# Altium project Contadores.PrjPcb
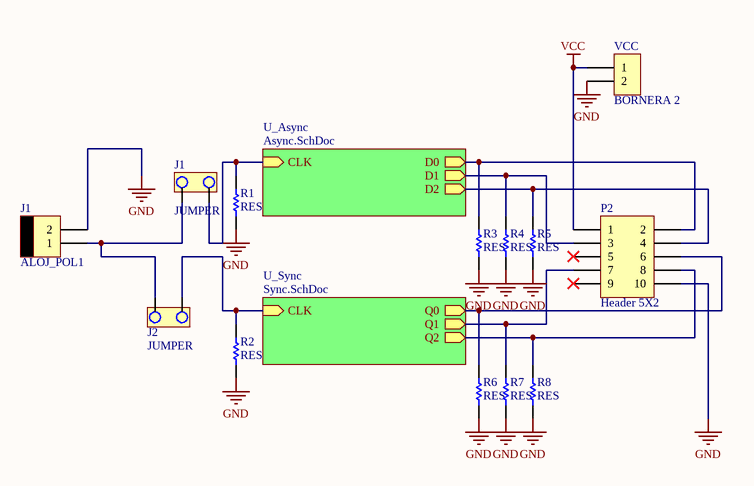
[diagram p0: Counters.SchDoc]
5 sheets, 41 parts. Net scope: hierarchical (ports join the sheet entries above them; power ports are global).
Board file: Counters.PcbDoc
Sheets:
  Counters.SchDoc
    U_Async = Async.SchDoc
      U_JK_FF3 = JK_FF.SchDoc
      U_JK_FF4 = JK_FF.SchDoc
      U_JK_FF5 = JK_FF.SchDoc
    U_Sync = Sync.SchDoc
      U_JK_FF_WITH_AND1 = JK_FF_WITH_AND.SchDoc
      U_JK_FF1 = JK_FF.SchDoc
      U_JK_FF2 = JK_FF.SchDoc

## Sheet Counters.SchDoc
size A

### Parts
(Parts that share a designator on the sheet are numbered #1, #2 ... from top to bottom, then left to right.)
J1#1  JUMPER  [JUMPER2]
J1#2  ALOJ_POL1  [MOLEX2]
J2#1  JUMPER  [JUMPER2]
P2  Header 5X2  [HDR2X5]
R1  RES  [RES400]
R2  RES  [RES400]
R3  RES  [RES400]
R4  RES  [RES400]
R5  RES  [RES400]
R6  RES  [RES400]
R7  RES  [RES400]
R8  RES  [RES400]
VCC  BORNERA 2  [BORNERA2]

### Sub-sheets
U_Async = Async.SchDoc: CLK (in), D0 (out), D1 (out), D2 (out)
U_Sync = Sync.SchDoc: Q0 (out), Q1 (out), Q2 (out), CLK (in)

### Nets
GND: J1#2.2 P2.10 R1.1 R2.1 R3.1 R4.1 R5.1 R6.1 R7.1 R8.1 VCC.2
VCC: P2.1 VCC.1
NetAND2_2: J2#1.2 R2.2 ; sheet U_Sync/CLK
NetAND2_8: P2.8 R8.2 ; sheet U_Sync/Q2
NetCD4073BM#1_2: J1#1.1 R1.2 ; sheet U_Async/CLK
NetCD4073BM#1_8: P2.2 R3.2 ; sheet U_Async/D0
NetCD4073BM#2_8: P2.3 R4.2 ; sheet U_Async/D1
NetCD4073BM#3_8: P2.4 R5.2 ; sheet U_Async/D2
NetCD4073BM#4_8: P2.6 R6.2 ; sheet U_Sync/Q0
NetCD4073BM#5_8: P2.7 R7.2 ; sheet U_Sync/Q1
NetJ1#1_2: J1#1.2 J1#2.1 J2#1.1

Not connected (* = marked no-connect by the designer): P2 5* 9*

### Library data of the parts
J1#2 = MOLEX2
P2 = Header 5X2: Header, 5-Pin, Dual row; LatestRevisionDate: 17-Jul-2002; LatestRevisionNote: Re-released for DXP Platform.; Publisher: Altium Limited

## Sheet Async.SchDoc
size B
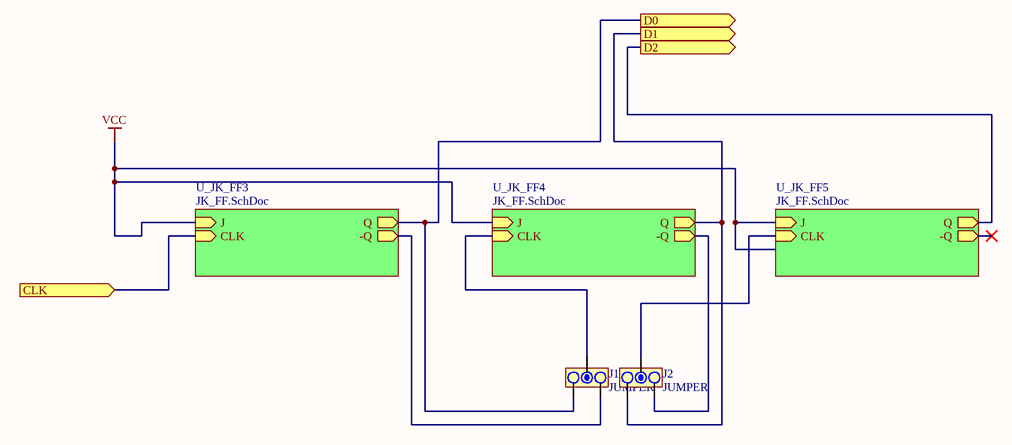
[diagram p1: Async.SchDoc]

### Parts
(Parts that share a designator on the sheet are numbered #1, #2 ... from top to bottom, then left to right.)
J1#3  JUMPER  [JUMPER3]
J2#2  JUMPER  [JUMPER3]

### Sub-sheets
U_JK_FF3 = JK_FF.SchDoc: J (in), CLK (in), Q (out), -Q (out)
U_JK_FF4 = JK_FF.SchDoc: J (in), CLK (in), Q (out), -Q (out)
U_JK_FF5 = JK_FF.SchDoc: J (in), CLK (in), Q (out), -Q (out)

### Ports
CLK (in), D0 (out), D1 (out), D2 (out)

### Nets
VCC: sheet U_JK_FF3/J, sheet U_JK_FF4/J, sheet U_JK_FF5/J
NetCD4073BM#1_2: port CLK, sheet U_JK_FF3/CLK
NetCD4073BM#1_5: J1#3.1 ; sheet U_JK_FF3/-Q
NetCD4073BM#1_8: J1#3.3 ; port D0, sheet U_JK_FF3/Q
NetCD4073BM#2_2: J1#3.2 ; sheet U_JK_FF4/CLK
NetCD4073BM#2_5: J2#2.1 ; sheet U_JK_FF4/-Q
NetCD4073BM#2_8: J2#2.3 ; port D1, sheet U_JK_FF4/Q
NetCD4073BM#3_2: J2#2.2 ; sheet U_JK_FF5/CLK
NetCD4073BM#3_8: port D2, sheet U_JK_FF5/Q

### Library data of the parts
J1#3 J2#2 = JUMPER3

## Sheet JK_FF.SchDoc
size A
Used 5 times, as channels U_Async/U_JK_FF3, U_Async/U_JK_FF4, U_Async/U_JK_FF5, U_Sync/U_JK_FF1, U_Sync/U_JK_FF2. Parts and nets are listed once, with the designators drawn on the sheet.
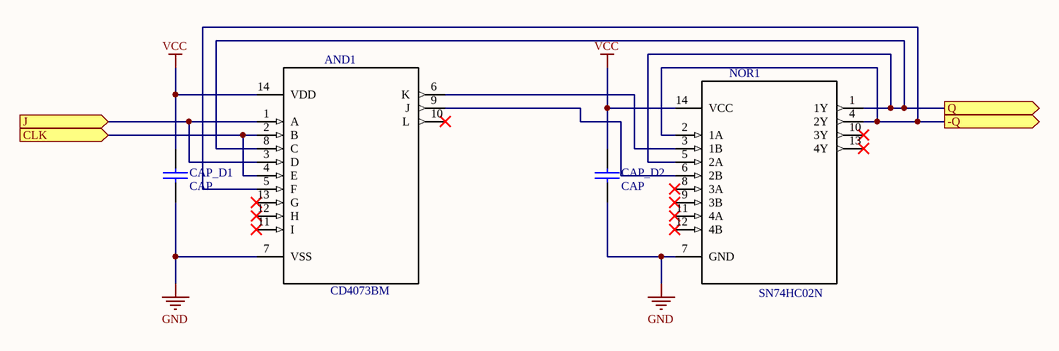
[diagram p2: JK_FF.SchDoc]

### Parts
AND1  CD4073BM  [*SOIC127P600X175-14N]
CAP_D1  CAP  [CAP200]
CAP_D2  CAP  [CAP200]
NOR1  SN74HC02N  [*DIP254P762X508-14]

### Ports
-Q (out), CLK (in), J (in), Q (out)

### Nets
GND: AND1.7(VSS) CAP_D1.2 CAP_D2.1 NOR1.7(GND)
VCC: AND1.14(VDD) CAP_D1.1 CAP_D2.2 NOR1.14(VCC)
-Q: AND1.5(F) NOR1.2(1A) NOR1.4(2Y) ; port -Q
CLK: AND1.2(B) AND1.4(E) ; port CLK
J: AND1.1(A) AND1.3(D) ; port J
Q: AND1.8(C) NOR1.1(1Y) NOR1.5(2A) ; port Q
NetAND1_6: AND1.6(K) NOR1.3(1B)
NetAND1_9: AND1.9(J) NOR1.6(2B)

Not connected (* = marked no-connect by the designer): AND1 10(L)* 11(I)* 12(H)* 13(G)*; NOR1 8(3A)* 9(3B)* 10(3Y)* 11(4A)* 12(4B)* 13(4Y)*

### Channels
U_Async/U_JK_FF3: designators AND1=CD4073BM#1 CAP_D1=100nF#1 CAP_D2=100nF#2 NOR1=SN74HC02N#1; ports -Q=NetCD4073BM#1_5 CLK=NetCD4073BM#1_2 J=VCC Q=NetCD4073BM#1_8
U_Async/U_JK_FF4: designators AND1=CD4073BM#2 CAP_D1=100nF#3 CAP_D2=100nF#4 NOR1=SN74HC02N#2; ports -Q=NetCD4073BM#2_5 CLK=NetCD4073BM#2_2 J=VCC Q=NetCD4073BM#2_8
U_Async/U_JK_FF5: designators AND1=CD4073BM#3 CAP_D1=100nF#5 CAP_D2=100nF#6 NOR1=SN74HC02N#3; ports -Q=NetCD4073BM#3_5 CLK=NetCD4073BM#3_2 J=VCC Q=NetCD4073BM#3_8
U_Sync/U_JK_FF1: designators AND1=CD4073BM#4 CAP_D1=100nF#7 CAP_D2=100nF#8 NOR1=SN74HC02N#4; ports -Q=NetCD4073BM#4_5 CLK=NetAND2_2 J=VCC Q=NetCD4073BM#4_8
U_Sync/U_JK_FF2: designators AND1=CD4073BM#5 CAP_D1=100nF#9 CAP_D2=100nF#10 NOR1=SN74HC02N#5; ports -Q=NetCD4073BM#5_5 CLK=NetAND2_2 J=NetAND2_12 Q=NetCD4073BM#5_8

### Library data of the parts
AND1 = CD4073BM: IC: digital; AND; Channels: 3; Inputs: 3; CMOS; SMD; SOP1; MF: Texas Instruments; Price: None; Package: SOIC-14 Texas Instruments; Availability: Unavailable; SnapEDA_Link: https://www.snapeda.com/parts/CD4073BM/Texas%20Instruments/view-part/?ref=snap; MP: CD4073BM; Value: *
NOR1 = SN74HC02N: IC: digital; Channels: 4; NOR; Inputs: 2; THT; DIP14; Ser; MF: Texas Instruments; Price: None; Package: DIP-14 Texas Instruments; Availability: Unavailable; SnapEDA_Link: https://www.snapeda.com/parts/SN74HC02N/Texas%20Instruments/view-part/?ref=snap; MP: SN74HC02N; Value: *

## Sheet Sync.SchDoc
size B
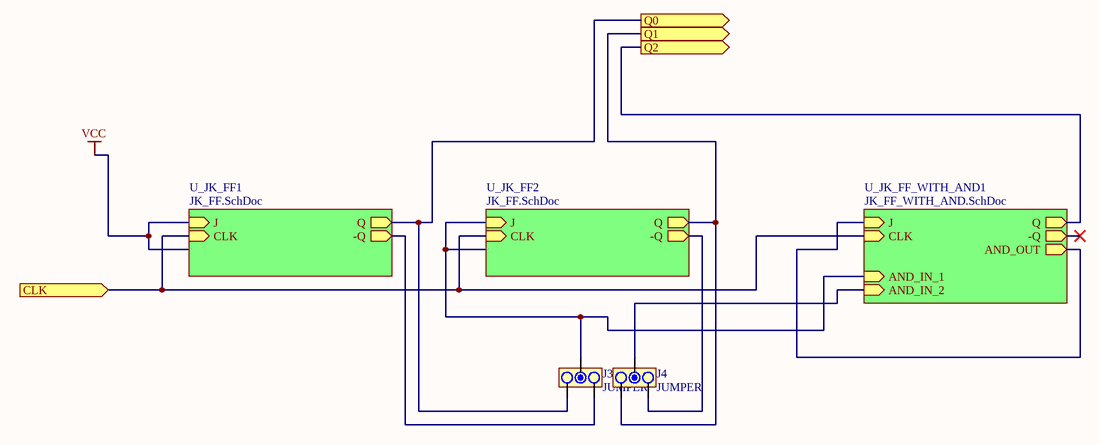
[diagram p3: Sync.SchDoc]

### Parts
J3  JUMPER  [JUMPER3]
J4  JUMPER  [JUMPER3]

### Sub-sheets
U_JK_FF1 = JK_FF.SchDoc: J (in), CLK (in), Q (out), -Q (out)
U_JK_FF2 = JK_FF.SchDoc: J (in), CLK (in), Q (out), -Q (out)
U_JK_FF_WITH_AND1 = JK_FF_WITH_AND.SchDoc: J (in), CLK (in), Q (out), -Q (out), AND_OUT (out), AND_IN_1 (in), AND_IN_2 (in)

### Ports
CLK (in), Q0 (out), Q1 (out), Q2 (out)

### Nets
NetAND2_1: sheet U_JK_FF_WITH_AND1/J, sheet U_JK_FF_WITH_AND1/AND_OUT
NetAND2_2: port CLK, sheet U_JK_FF_WITH_AND1/CLK, sheet U_JK_FF1/CLK, sheet U_JK_FF2/CLK
NetAND2_8: port Q2, sheet U_JK_FF_WITH_AND1/Q
NetAND2_11: J4.2 ; sheet U_JK_FF_WITH_AND1/AND_IN_2
NetAND2_12: J3.2 ; sheet U_JK_FF_WITH_AND1/AND_IN_1, sheet U_JK_FF2/J
NetCD4073BM#4_5: J3.1 ; sheet U_JK_FF1/-Q
NetCD4073BM#4_8: J3.3 ; port Q0, sheet U_JK_FF1/Q
NetCD4073BM#5_5: J4.1 ; sheet U_JK_FF2/-Q
NetCD4073BM#5_8: J4.3 ; port Q1, sheet U_JK_FF2/Q

### Library data of the parts
J3 J4 = JUMPER3

## Sheet JK_FF_WITH_AND.SchDoc
size A
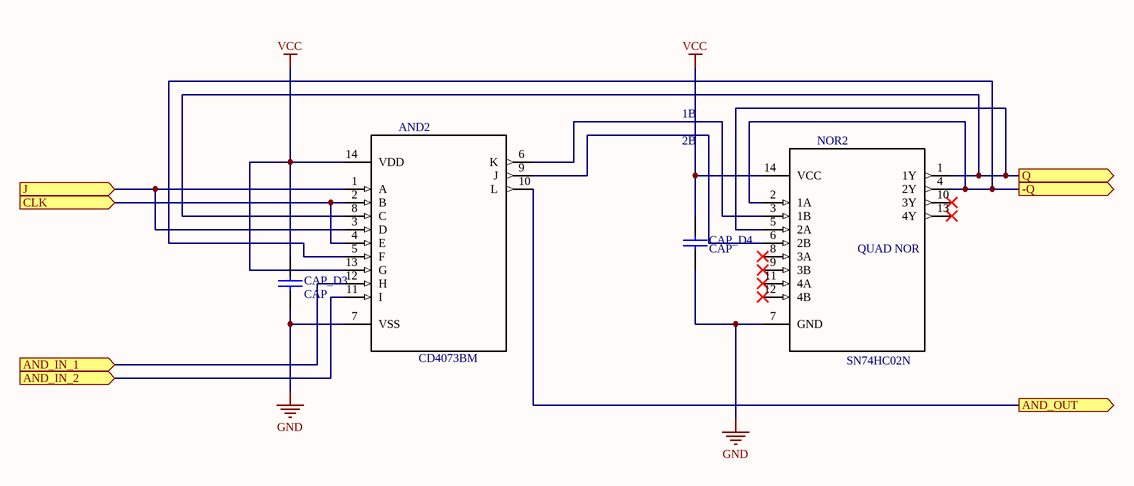
[diagram p4: JK_FF_WITH_AND.SchDoc]

### Parts
AND2  CD4073BM  [*SOIC127P600X175-14N]
CAP_D3  CAP  [CAP200]
CAP_D4  CAP  [CAP200]
NOR2  SN74HC02N  [*DIP254P762X508-14]

### Ports
-Q (out), AND_IN_1 (in), AND_IN_2 (in), AND_OUT (out), CLK (in), J (in), Q (out)

### Nets
GND: AND2.7(VSS) CAP_D3.2 CAP_D4.2 NOR2.7(GND)
VCC: AND2.13(G) AND2.14(VDD) CAP_D3.1 CAP_D4.1 NOR2.14(VCC)
NetAND2_1: AND2.1(A) AND2.3(D) AND2.10(L) ; port J, port AND_OUT
NetAND2_2: AND2.2(B) AND2.4(E) ; port CLK
NetAND2_5: AND2.5(F) NOR2.2(1A) NOR2.4(2Y) ; port -Q
NetAND2_6: AND2.6(K) NOR2.3(1B)
NetAND2_8: AND2.8(C) NOR2.1(1Y) NOR2.5(2A) ; port Q
NetAND2_9: AND2.9(J) NOR2.6(2B)
NetAND2_11: AND2.11(I) ; port AND_IN_2
NetAND2_12: AND2.12(H) ; port AND_IN_1

Not connected (* = marked no-connect by the designer): NOR2 8(3A)* 9(3B)* 10(3Y)* 11(4A)* 12(4B)* 13(4Y)*

### Notes on the sheet
- 1B
- 2B
- (near NOR2) QUAD NOR

### Library data of the parts
AND2 = CD4073BM: as AND1 on sheet JK_FF; Price: None; Package: SOIC-14 Texas Instruments; Availability: Unavailable; SnapEDA_Link: https://www.snapeda.com/parts/CD4073BM/Texas%20Instruments/view-part/?ref=snap; MP: CD4073BM; Value: *
NOR2 = SN74HC02N: as NOR1 on sheet JK_FF; Price: None; Package: DIP-14 Texas Instruments; Availability: Unavailable; SnapEDA_Link: https://www.snapeda.com/parts/SN74HC02N/Texas%20Instruments/view-part/?ref=snap; MP: SN74HC02N; Value: *

## Nets that join several sheets
GND: Counters (11 pins), U_Async/U_JK_FF3 (100nF#1.2 100nF#2.1 CD4073BM#1.7 SN74HC02N#1.7), U_Async/U_JK_FF4 (100nF#3.2 100nF#4.1 CD4073BM#2.7 SN74HC02N#2.7), U_Async/U_JK_FF5 (100nF#5.2 100nF#6.1 CD4073BM#3.7 SN74HC02N#3.7), JK_FF_WITH_AND (AND2.7 CAP_D3.2 CAP_D4.2 NOR2.7), U_Sync/U_JK_FF1 (100nF#7.2 100nF#8.1 CD4073BM#4.7 SN74HC02N#4.7), U_Sync/U_JK_FF2 (100nF#9.2 100nF#10.1 CD4073BM#5.7 SN74HC02N#5.7)
VCC: Counters (P2.1 VCC.1), U_Async/U_JK_FF3 (6 pins), U_Async/U_JK_FF4 (6 pins), U_Async/U_JK_FF5 (6 pins), JK_FF_WITH_AND (5 pins), U_Sync/U_JK_FF1 (6 pins), U_Sync/U_JK_FF2 (100nF#9.1 100nF#10.2 CD4073BM#5.14 SN74HC02N#5.14)
NetAND2_2: Counters (J2#1.2 R2.2), JK_FF_WITH_AND (AND2.2 AND2.4), U_Sync/U_JK_FF1 (CD4073BM#4.2 CD4073BM#4.4), U_Sync/U_JK_FF2 (CD4073BM#5.2 CD4073BM#5.4)
NetAND2_8: Counters (P2.8 R8.2), JK_FF_WITH_AND (AND2.8 NOR2.1 NOR2.5)
NetAND2_11: Sync (J4.2), JK_FF_WITH_AND (AND2.11)
NetAND2_12: Sync (J3.2), JK_FF_WITH_AND (AND2.12), U_Sync/U_JK_FF2 (CD4073BM#5.1 CD4073BM#5.3)
NetCD4073BM#1_2: Counters (J1#1.1 R1.2), U_Async/U_JK_FF3 (CD4073BM#1.2 CD4073BM#1.4)
NetCD4073BM#1_5: Async (J1#3.1), U_Async/U_JK_FF3 (CD4073BM#1.5 SN74HC02N#1.2 SN74HC02N#1.4)
NetCD4073BM#1_8: Counters (P2.2 R3.2), Async (J1#3.3), U_Async/U_JK_FF3 (CD4073BM#1.8 SN74HC02N#1.1 SN74HC02N#1.5)
NetCD4073BM#2_2: Async (J1#3.2), U_Async/U_JK_FF4 (CD4073BM#2.2 CD4073BM#2.4)
NetCD4073BM#2_5: Async (J2#2.1), U_Async/U_JK_FF4 (CD4073BM#2.5 SN74HC02N#2.2 SN74HC02N#2.4)
NetCD4073BM#2_8: Counters (P2.3 R4.2), Async (J2#2.3), U_Async/U_JK_FF4 (CD4073BM#2.8 SN74HC02N#2.1 SN74HC02N#2.5)
NetCD4073BM#3_2: Async (J2#2.2), U_Async/U_JK_FF5 (CD4073BM#3.2 CD4073BM#3.4)
NetCD4073BM#3_8: Counters (P2.4 R5.2), U_Async/U_JK_FF5 (CD4073BM#3.8 SN74HC02N#3.1 SN74HC02N#3.5)
NetCD4073BM#4_5: Sync (J3.1), U_Sync/U_JK_FF1 (CD4073BM#4.5 SN74HC02N#4.2 SN74HC02N#4.4)
NetCD4073BM#4_8: Counters (P2.6 R6.2), Sync (J3.3), U_Sync/U_JK_FF1 (CD4073BM#4.8 SN74HC02N#4.1 SN74HC02N#4.5)
NetCD4073BM#5_5: Sync (J4.1), U_Sync/U_JK_FF2 (CD4073BM#5.5 SN74HC02N#5.2 SN74HC02N#5.4)
NetCD4073BM#5_8: Counters (P2.7 R7.2), Sync (J4.3), U_Sync/U_JK_FF2 (CD4073BM#5.8 SN74HC02N#5.1 SN74HC02N#5.5)